# Altium schematic sheet short_circuit_protection.SchDoc
size A; SheetNumber: 1; SheetTotal: 1
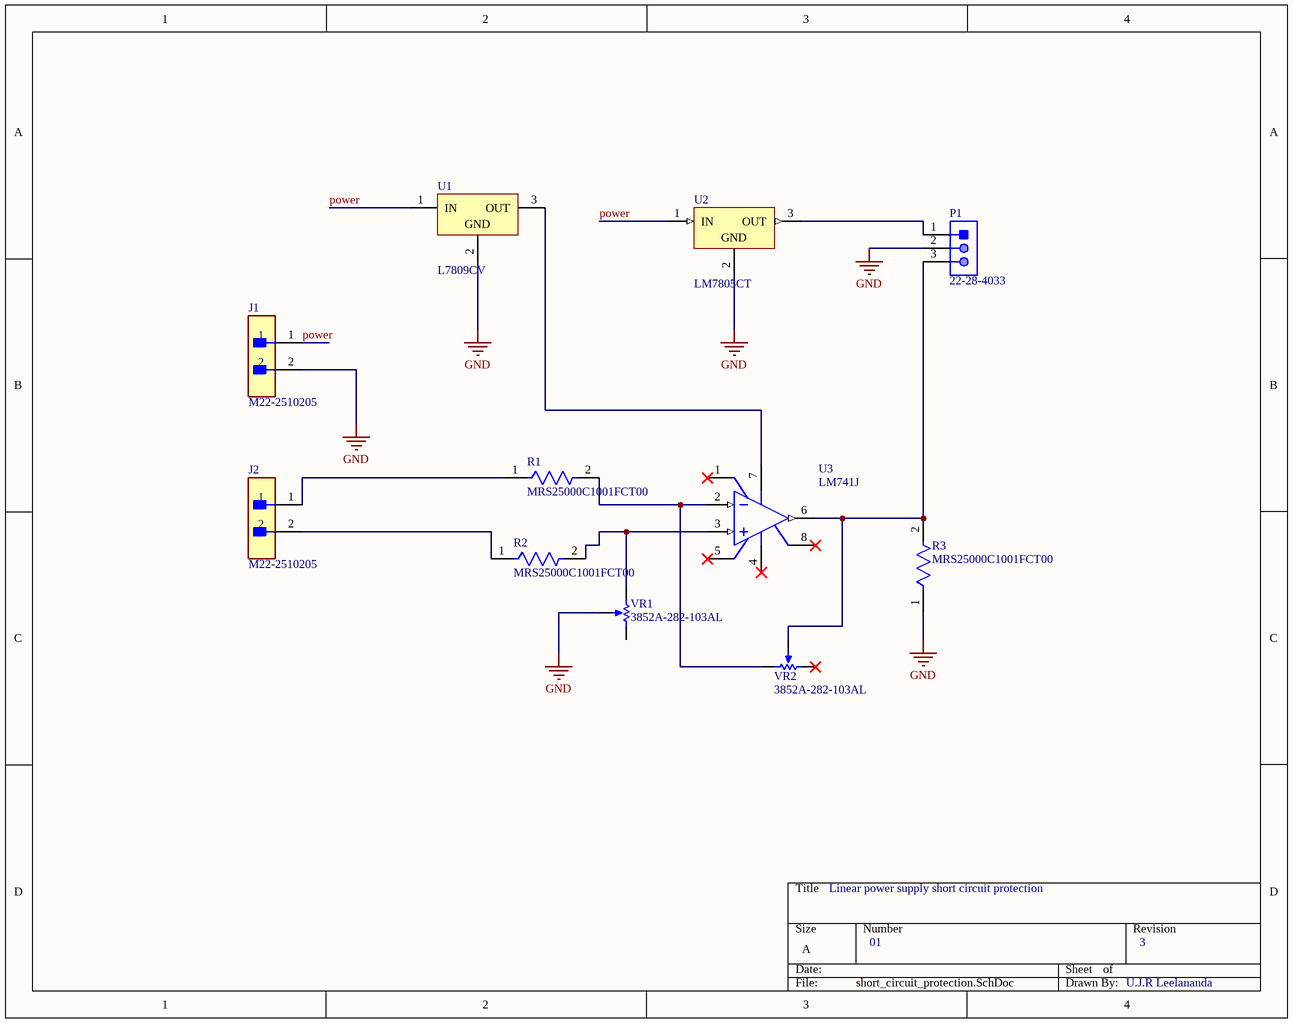
[diagram p0: short_circuit_protection.SchDoc]

## Parts
J1  M22-2510205  [FP-M22-2510205-MFG]
J2  M22-2510205  [FP-M22-2510205-MFG]
P1  22-28-4033  [MOLX-22-28-4033_V]
R1  MRS25000C1001FCT00  [FP-MRS25-MFG]
R2  MRS25000C1001FCT00  [FP-MRS25-MFG]
R3  MRS25000C1001FCT00  [FP-MRS25-MFG]
U1  L7809CV  [TO220]
U2  LM7805CT  [FAIR-TO-220-3]
U3  LM741J  [NAB0008A]
VR1  3852A-282-103AL  [BOUR-3852A-282-103AL-3_V]
VR2  3852A-282-103AL  [BOUR-3852A-282-103AL-3_V]

## Nets
GND: J1.2 P1.2 R3.1 U1.2(GND) U2.2(GND) VR1.2(S)
power: J1.1 U1.1(IN) U2.1(IN)
NetJ2_1: J2.1 R1.1
NetJ2_2: J2.2 R2.1
NetP1_1: P1.1 U2.3(OUT)
NetP1_3: P1.3 R3.2 U3.6(OUT) VR2.2(S)
NetR1_2: R1.2 U3.2(IN-) VR2.3(CW)
NetR2_2: R2.2 U3.3(IN+) VR1.1(CCW)
NetU1_3: U1.3(OUT) U3.7(V+)

Not connected (* = marked no-connect by the designer): U3 1(OFS_NULL)* 4(V-)* 5(OFS_NULL)* 8(NC)*; VR1 3(CW); VR2 1(CCW)*

## Notes on the sheet
- Linear power supply short circuit protection
- 01
- 3
- U.J.R Leelananda

## Library data of the parts
J1 J2 = CMP-15831-000005-1: CONN HEADER VERT 2POS 2MM; Manufacturer: Harwin; Conn Gender: Male; Current Rating: 2A; Number Of Contacts: 2; Conn Orientation: Vertical; Temperature Range Low: -40°C; Device Class L1: Connectors; ComponentLink2URL: https://cdn.harwin.com/pdfs/C018XX_M22_Series_Connectors.pdf; Temperature Range High: +105°C; Pitch: 2mm; Number Of Rows: 1; Temperature: -40°C to +105°C; Automotive: No; Device Class L3: unset; Octopart: https://octopart.com/m22-2510205-harwin-2538221; Mouser Description: Headers & Wire Housings 2 PIN SIL VERTICAL GOLD PIN HEADER; Height: 5.45mm; Category: Conn; Digikey Description: CONN HEADER VERT 2POS 2MM; Contact Material: Gold,Nickel; Lead Free: Yes; ComponentLink2Description: Datasheet; Manufacturer Part Number: M22-2510205; Device Class L2: Headers and Wire Housings; Package: 0; Footprint Url: https://cdn.harwin.com/pdfs/M22-251.pdf; RoHS: TRUE
P1 = CMP-1676-00001-5: Male Header, Pitch 2.54 mm, 1 x 3 Position, Height 8.38 mm, Tail Length 3.18 mm, RoHS, Bulk; Manufacturer: Molex; Rows: 1; Voltage Rating: 250 V; Current Rating: 4 A; Min Operating Temperature: 0 degC; Lead Pitch: 0.1 inch; Packaging: Bulk; Contact Finish: Gold; RoHSCompliant: true; Contact Material: Brass; PackageReference: 22-28-4033; REACH SVHC: Unknown; PackageDescription: Male Header, Pitch 2.54 mm, 1 x 3 Position, Height 8.38 mm, Tail Length 3.18 mm; ComponentLink2URL: http://www.molex.com/pdm_docs/sd/022284033_sd.pdf; Height: 8.38 mm; Mounting Technology: Through Hole; ComponentLink1Description: Manufacturer URL; Length: 7.62 mm; Mount: Through Hole; DatasheetVersion: Rev. G, 01/2012; Max Operating Temperature: 75 degC; ComponentLink2Description: Datasheet; Colour: Black; Pins: 3; Contact Plating: Gold; Package Quantity: 1; ComponentLink1URL: http://www.molex.com/
R1-R3 = CMP-02408-000051-1: RES 1K OHM 0.6W 1% AXIAL; Power Rating: 600mW; Lead Diameter: 0.6mm; Voltage Rating (DC): 350V; Resistance: 1kR; Temperature Coefficient: 50ppm/°C; Width: 2.5mm; Military Standard: Not; Package Quantity: 5000; Radiation Hardening: No; Case/Package: Axial; Resistance Tolerance: 1%; Resistor Type: Metal Film; Contact Plating: Tin; Length: 6.5mm; Lead Free: Lead Free; RoHS Compliant: Yes; Mount: Through Hole; Number of Pins: 2; Technology: THIN FILM; Voltage Rating: 350V; Min Operating Temperature: -55°C; Weight: 0.00776oz; Diameter: 2.5mm; Construction: Cylindrical; Series: MRS25; Tolerance: 1%; Packaging: Tape and Reel; Max Operating Temperature: 155°C; Max Power Dissipation: 600mW; Number of Terminations: 2; Termination: Axial
U1 = CMP-0244-00459-1: Positive Voltage Regulator, 9V, 3-Pin TO-220; ComponentLink3URL: http://www.st.com/internet/com/TECHNICAL_RESOURCES/TECHNICAL_LITERATURE/PACKAGE_INFORMATION/CD00004649.pdf; ComponentLink2Description: Datasheet; DatasheetVersion: 16/11/2011; PackageVersion: ver3.0; PackageDescription: TO, Thru-Hole, Vertical, Heatsink Mounted; 3 In-Line Leads; Pitch 2.54 mm; ComponentLink3Description: Package Specification; ComponentLink2URL: http://www.st.com/internet/com/TECHNICAL_RESOURCES/TECHNICAL_LITERATURE/DATASHEET/CD00000444.pdf; ComponentLink1URL: http://www.st.com; ComponentLink1Description: Manufacturer URL; PackageReference: TO220
U2 = CMP-2000-04938-1: Positive Voltage Regulator, 5 V, 1 A, -40 to 125 degC, 3-Pin TO-220, RoHS, Tube; Manufacturer: FairchildSemiconductor; Maximum Input Voltage: 35V; Maximum Quiescent Current: 8mA; Load Regulation: 100mV; Maximum Output Current: 2.2(Typ)A; Output Type: Fixed; Typical Dropout Voltage @ Current: 2@1AV; Rad Hard: No; Output Voltage: 5V; Accuracy: ±4%; Number of Outputs: 1; Category: LinearRegulator; Package Description: 3-Pin Through Hole Device, Body 10 x 4.5 mm, Pitch 2.54 mm; Packaging: Rail/Tube; Mounting: ThroughHole; Polarity: Positive; Manufacturer URL: https://www.fairchildsemi.com/; Line Regulation: 100mV; Datasheet Version: Aug-12; Datasheet URL: https://datasheet.ciiva.com/26904/lm7805ct-26904988.pdf; Package Reference: TO-220; Package URL: https://www.fairchildsemi.com/package-drawings/TO/TO220B03.pdf; Package: 3TO-220AB; Operating Temperature: -40to125degC; Type: Linear
U3 = CMP-0055-00160-3: Operational Amplifier, 8-pin CerDIP; Manufacturer: Texas Instruments; PackageTopMarking: NSUZXYTT*LM741J; CompType: Amplifiers; PowerWise: N; PackageDescription: Cerdip, .400 x .310in Body, 8 Lead, .300in Centers, .100in Pitch; PinCount: 8; RoHS: N; Package Reference: NAB0008A; ComponentLink1Description: Datasheet URL; ComponentLink1URL: http://www.ti.com/general/docs/lit/getliterature.tsp?genericPartNumber=LM741&fileType=pdf
VR1 VR2 = CMP-2000-05079-1: Diameter Panel Control, 10 KOhm, +/- 10%, 2 W, -1 to 125 degC, 3-Pin THD, RoHS, Bulk; Manufacturer: Bourns; Temperature Coefficient: ±150ppm/degC; Number of Gangs: 1; Other Names: 3852A282103AL; Actuator Length: 0.875"(22.23mm); Resistive Material: Cermet; PCN Design/Specification: PBTResinJun/2011; Rotation: 280deg; PCN Other: MultipleChanges01/Dec/2012; Catalog Drawings: 3852SeriesSide1 / 3852SeriesSide2; Online Catalog: 3852and3856Series; Associated Product: 36-8560-ND / -KNOBINSTRUMW/DIALRND.9"DIA / 36-8555-ND / -KNOBINSTRUMSKIRTEDRND.7"DIA / 36-8556-ND / -KNOBINSTRUMSKIRTEDRND.9"DIA / 36-8565-ND / -KNOBINSTRUMDBLBARRND.7"DIA / 36-8566-ND / -KNOBINSTRUMDBLBARRND.9"DIA / 36-8568-ND / -KNOBINSTRUMSGLBARRND.7"DIA / 36-8569-ND / -KNOBINSTRUMSGLBARRND.9"DIA / 36-8559-ND / -KNOBINSTRUMW/DIALRND.7"DIA / 226-1006-ND / -KNOBBLKGLOSS.75"DIA.250"SHAFT / 226-1007-ND / -KNOBBLKGLOSS.925"DIA.250"SHAFT / 226-1011-ND / -KNOBBLKGLOS; Actuator Diameter: 0.250"(6.35mm); Built in Switch: None; Resistance (Ohms): 10k; Power (Watts): 2W; Actuator Type: Slotted; Standard Package: 45; Tolerance: ±10%; Taper: Linear; Series: 3852; Packaging: Bulk; Category: Potentiometers,VariableResistors; Bushing Thread: 3/8-32; Datasheet URL: https://datasheet.ciiva.com/11831/0900766b80f93b4b-11831016.pdf; Datasheet Version: Sep-14; Number of Turns: 1; Family: RotaryPotentiometers,Rheostats; Termination Style: SolderLug; RoHS Information: 3852A-LMaterialDeclaration; Mounting Type: PanelMount; Manufacturer URL: http://www.bourns.com/